# Altium schematic sheet 12 Processor  Power.SchDoc
size 594 x 420 mm
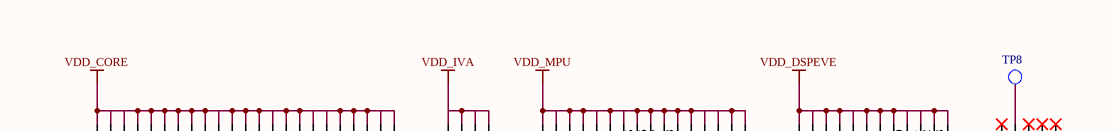
[diagram p0: 12 Processor  Power.SchDoc, top left]
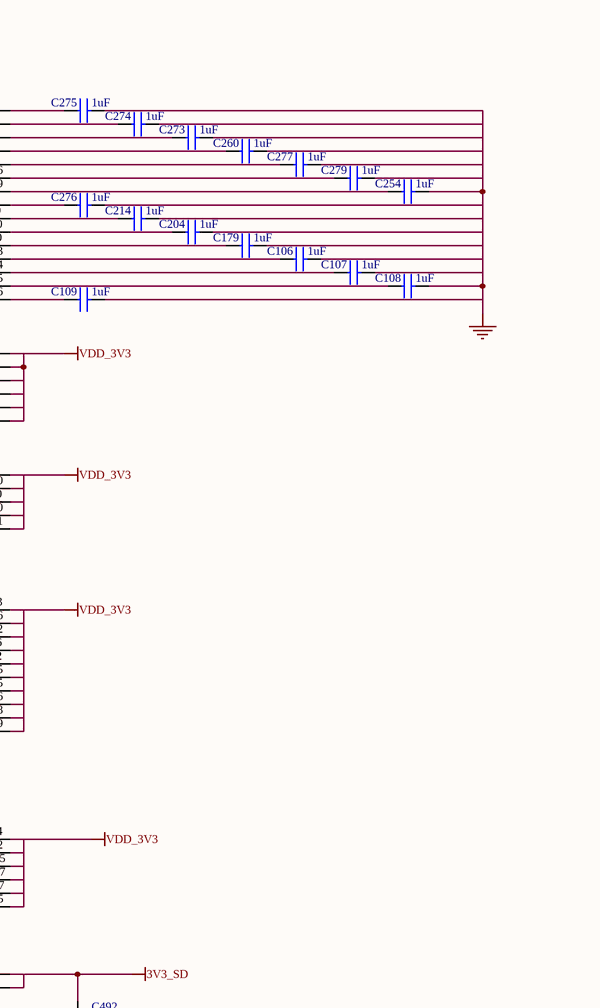
[diagram p1: 12 Processor  Power.SchDoc, top right]
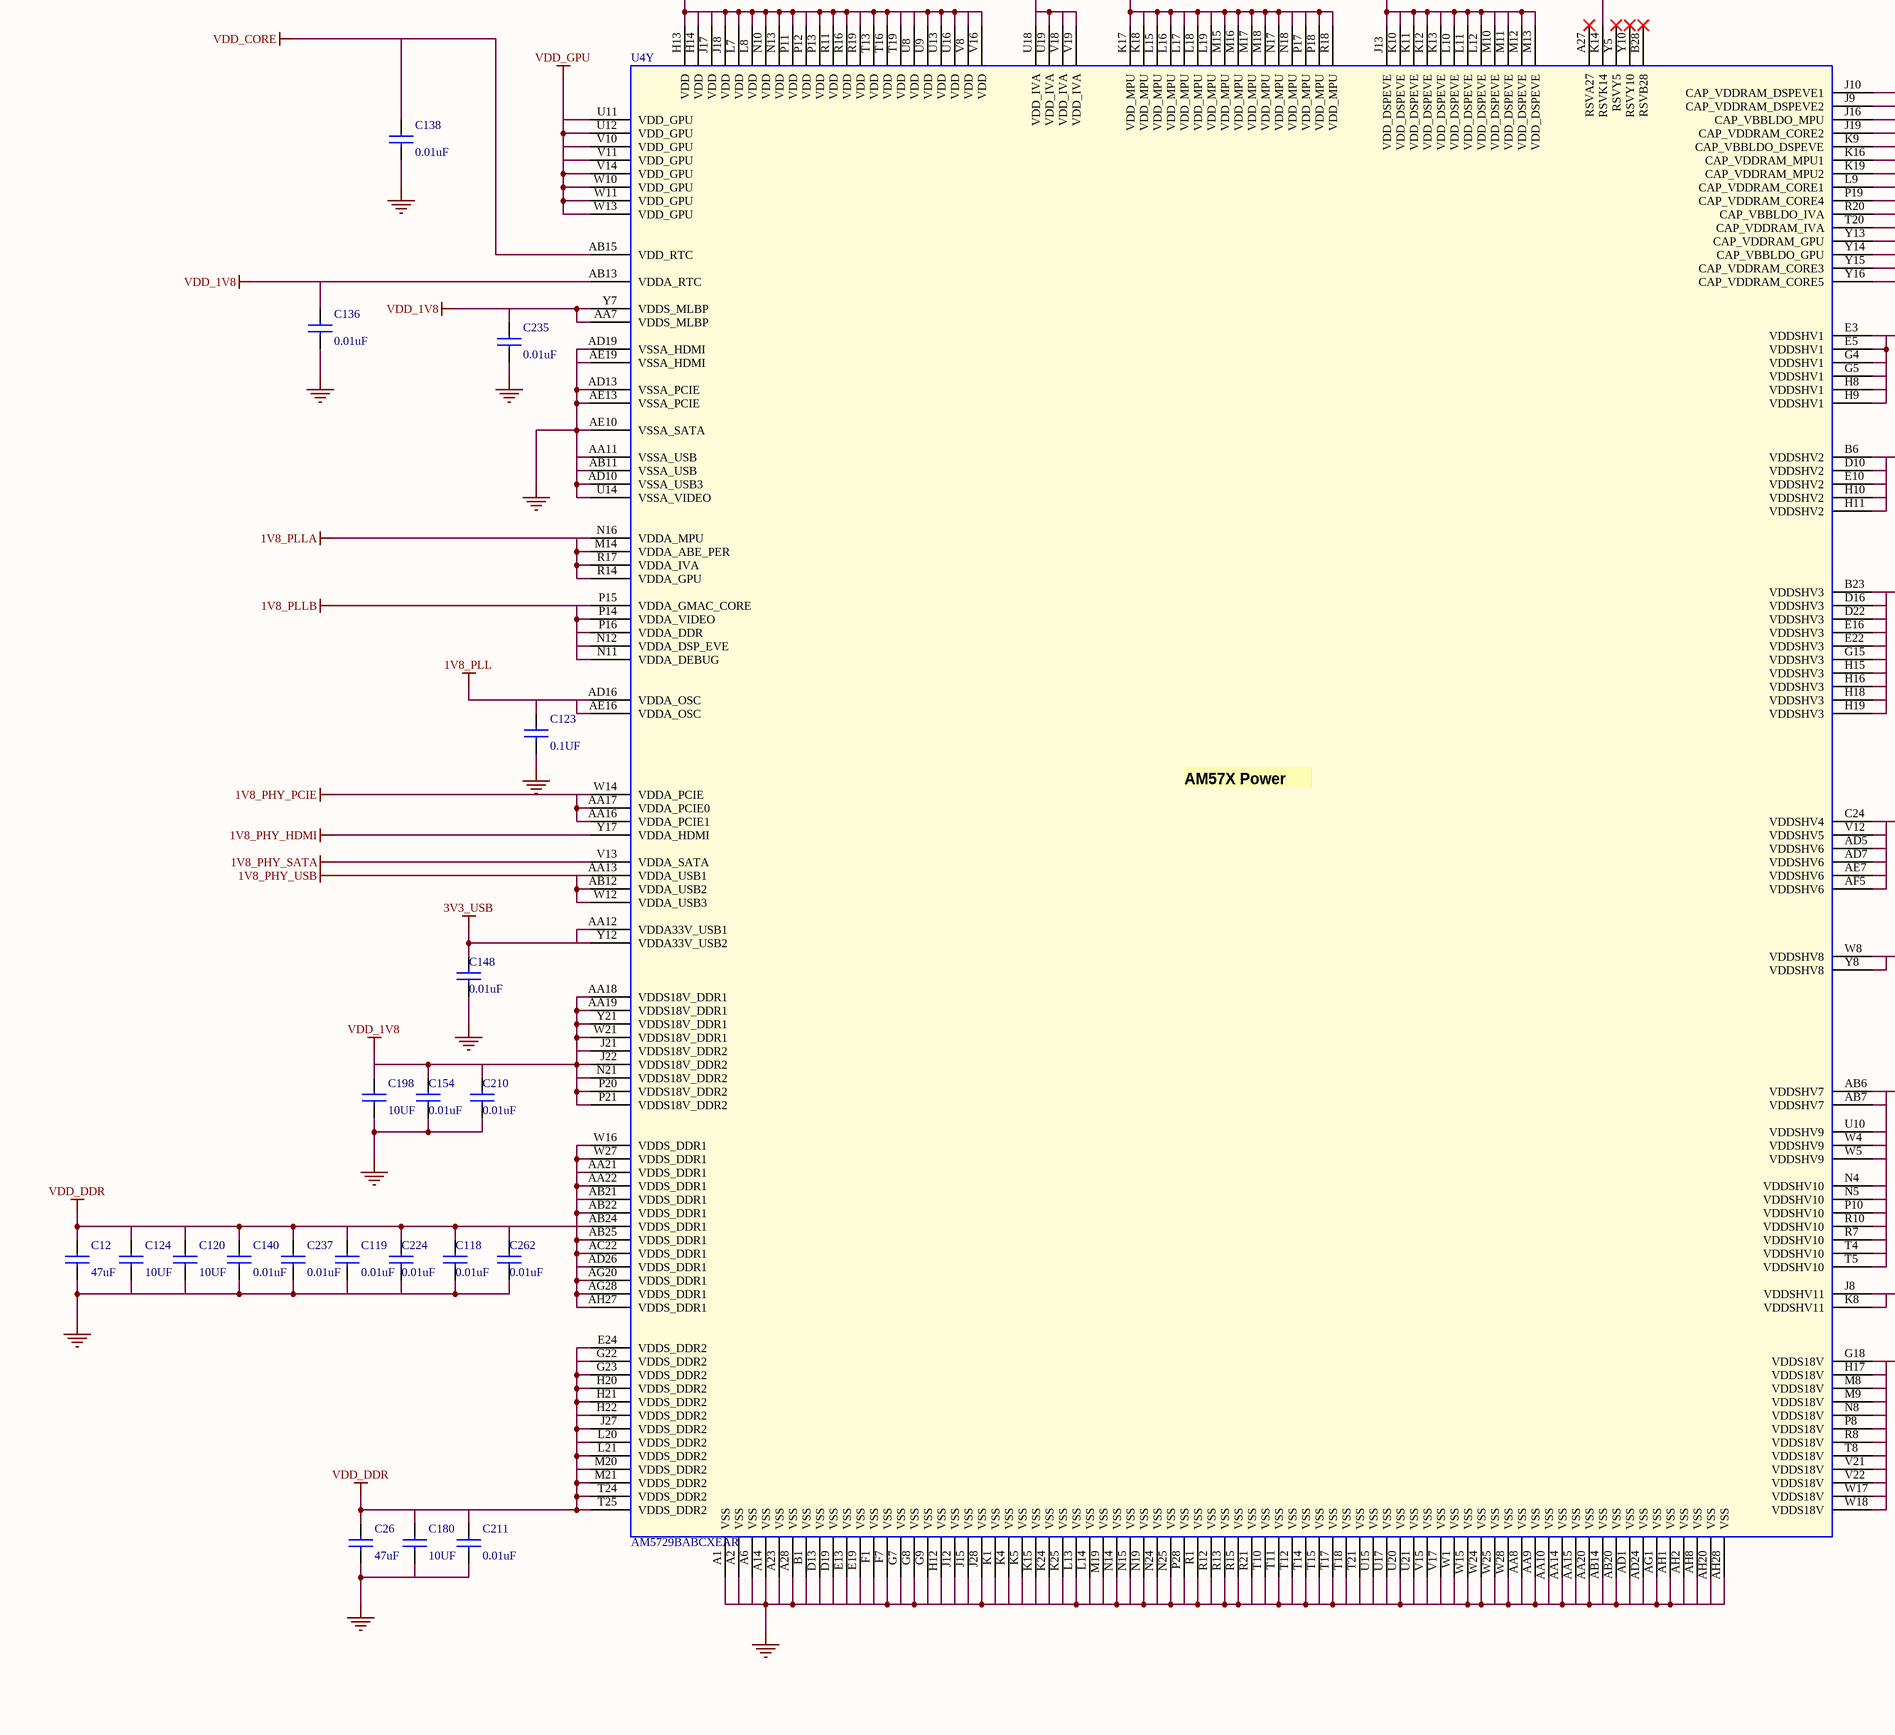
[diagram p2: 12 Processor  Power.SchDoc, bottom left]
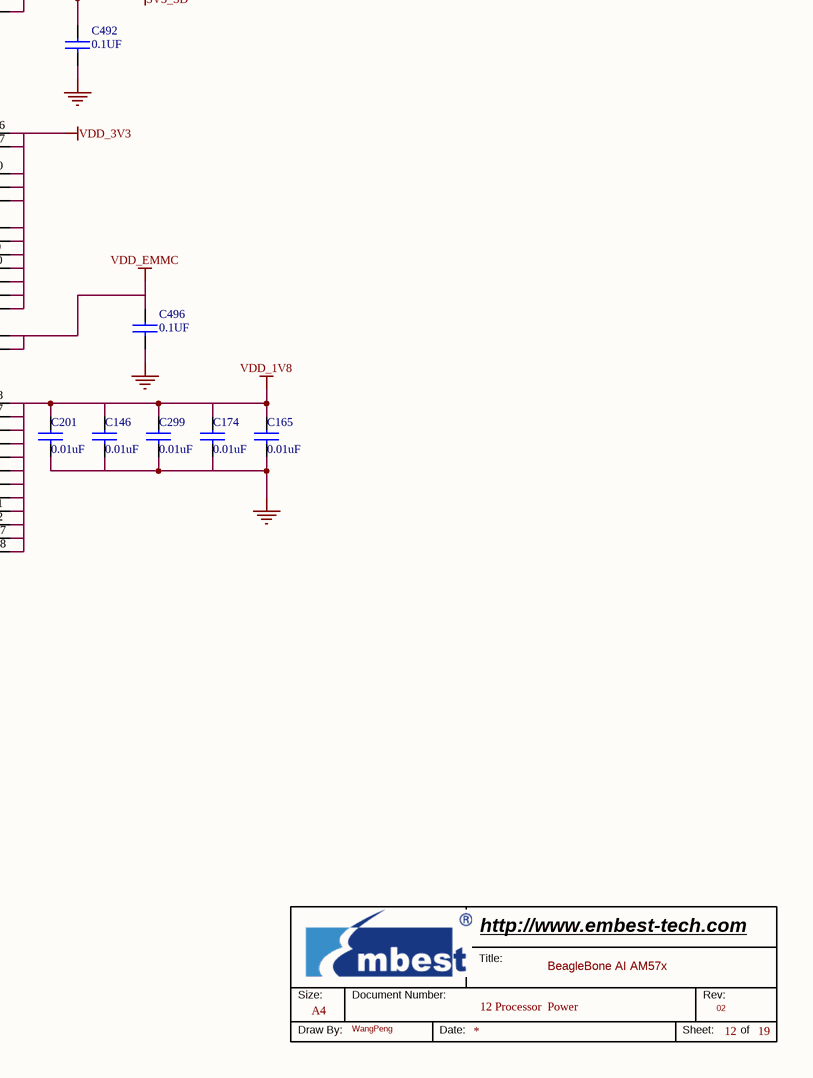
[diagram p3: 12 Processor  Power.SchDoc, bottom right]

## Parts
*  Page Count: 19  Page Number: 12  Page Size: A4  Title: BeagleBone AI AM57x  RevCode: 02  Doc: 12 Processor  Power  Drawing: WangPeng  (hidden comment: Embest Title)  (graphical)
C12  47uF  [C0805]
C26  47uF  [C0805]
C106  1uF  [C0402]
C107  1uF  [C0402]
C108  1uF  [C0402]
C109  1uF  [C0402]
C118  0.01uF  [C0402]
C119  0.01uF  [C0402]
C120  10UF  [C0603]
C123  0.1UF  [C0402]
C124  10UF  [C0603]
C136  0.01uF  [C0402]
C138  0.01uF  [C0402]
C140  0.01uF  [C0402]
C146  0.01uF  [C0402]
C148  0.01uF  [C0402]
C154  0.01uF  [C0402]
C165  0.01uF  [C0402]
C174  0.01uF  [C0402]
C179  1uF  [C0402]
C180  10UF  [C0603]
C198  10UF  [C0603]
C201  0.01uF  [C0402]
C204  1uF  [C0402]
C210  0.01uF  [C0402]
C211  0.01uF  [C0402]
C214  1uF  [C0402]
C224  0.01uF  [C0402]
C235  0.01uF  [C0402]
C237  0.01uF  [C0402]
C254  1uF  [C0402]
C260  1uF  [C0402]
C262  0.01uF  [C0402]
C273  1uF  [C0402]
C274  1uF  [C0402]
C275  1uF  [C0402]
C276  1uF  [C0402]
C277  1uF  [C0402]
C279  1uF  [C0402]
C299  0.01uF  [C0402]
C492  0.1UF  [C0402]
C496  0.1UF  [C0402]
TP8  NI  [TP1-8040]  (value not drawn)
U4  AM5729BABCXEAR  [BGA23X23-760-117M]  (part Y of 29)

## Nets
1V8_PHY_HDMI: U4.Y17(VDDA_HDMI)
1V8_PHY_PCIE: U4.AA16(VDDA_PCIE1) U4.AA17(VDDA_PCIE0) U4.W14(VDDA_PCIE)
1V8_PHY_SATA: U4.V13(VDDA_SATA)
1V8_PHY_USB: U4.AA13(VDDA_USB1) U4.AB12(VDDA_USB2) U4.W12(VDDA_USB3)
1V8_PLL: C123.1 U4.AD16(VDDA_OSC) U4.AE16(VDDA_OSC)
1V8_PLLA: U4.M14(VDDA_ABE_PER) U4.N16(VDDA_MPU) U4.R14(VDDA_GPU) U4.R17(VDDA_IVA)
1V8_PLLB: U4.N11(VDDA_DEBUG) U4.N12(VDDA_DSP_EVE) U4.P14(VDDA_VIDEO) U4.P15(VDDA_GMAC_CORE) U4.P16(VDDA_DDR)
3V3_SD: C492.1 U4.W8(VDDSHV8) U4.Y8(VDDSHV8)
3V3_USB: C148.1 U4.AA12(VDDA33V_USB1) U4.Y12(VDDA33V_USB2)
GND: C12.2 C26.2 C106.2 C107.2 C108.2 C109.2 C118.2 C119.2 C120.2 C123.2 C124.2 C136.2 C138.2 C140.2 C146.2 C148.2 C154.2 C165.2 C174.2 C179.2 C180.2 C198.2 C201.2 C204.2 C210.2 C211.2 C214.2 C224.2 C235.2 C237.2 C254.2 C260.2 C262.2 C273.2 C274.2 C275.2 C276.2 C277.2 C279.2 C299.2 C492.2 C496.2 U4.A1(VSS) U4.A2(VSS) U4.A6(VSS) U4.A14(VSS) U4.A23(VSS) U4.A28(VSS) U4.AA8(VSS) U4.AA9(VSS) U4.AA10(VSS) U4.AA11(VSSA_USB) U4.AA14(VSS) U4.AA15(VSS) U4.AA20(VSS) U4.AB11(VSSA_USB) U4.AB14(VSS) U4.AB20(VSS) U4.AD1(VSS) U4.AD10(VSSA_USB3) U4.AD13(VSSA_PCIE) U4.AD19(VSSA_HDMI) U4.AD24(VSS) U4.AE10(VSSA_SATA) U4.AE13(VSSA_PCIE) U4.AE19(VSSA_HDMI) U4.AG1(VSS) U4.AH1(VSS) U4.AH2(VSS) U4.AH8(VSS) U4.AH20(VSS) U4.AH28(VSS) U4.B1(VSS) U4.D13(VSS) U4.D19(VSS) U4.E13(VSS) U4.E19(VSS) U4.F1(VSS) U4.F7(VSS) U4.G7(VSS) U4.G8(VSS) U4.G9(VSS) U4.H12(VSS) U4.J12(VSS) U4.J15(VSS) U4.J28(VSS) U4.K1(VSS) U4.K4(VSS) U4.K5(VSS) U4.K15(VSS) U4.K24(VSS) U4.K25(VSS) U4.L13(VSS) U4.L14(VSS) U4.M19(VSS) U4.N14(VSS) U4.N15(VSS) U4.N19(VSS) U4.N24(VSS) U4.N25(VSS) U4.P28(VSS) U4.R1(VSS) U4.R12(VSS) U4.R13(VSS) U4.R15(VSS) U4.R21(VSS) U4.T10(VSS) U4.T11(VSS) U4.T12(VSS) U4.T14(VSS) U4.T15(VSS) U4.T17(VSS) U4.T18(VSS) U4.T21(VSS) U4.U14(VSSA_VIDEO) U4.U15(VSS) U4.U17(VSS) U4.U20(VSS) U4.U21(VSS) U4.V15(VSS) U4.V17(VSS) U4.W1(VSS) U4.W15(VSS) U4.W24(VSS) U4.W25(VSS) U4.W28(VSS)
VDD_1V8: C136.1 C146.1 C154.1 C165.1 C174.1 C198.1 C201.1 C210.1 C235.1 C299.1 U4.AA7(VDDS_MLBP) U4.AA18(VDDS18V_DDR1) U4.AA19(VDDS18V_DDR1) U4.AB13(VDDA_RTC) U4.G18(VDDS18V) U4.H17(VDDS18V) U4.J21(VDDS18V_DDR2) U4.J22(VDDS18V_DDR2) U4.M8(VDDS18V) U4.M9(VDDS18V) U4.N8(VDDS18V) U4.N21(VDDS18V_DDR2) U4.P8(VDDS18V) U4.P20(VDDS18V_DDR2) U4.P21(VDDS18V_DDR2) U4.R8(VDDS18V) U4.T8(VDDS18V) U4.V21(VDDS18V) U4.V22(VDDS18V) U4.W17(VDDS18V) U4.W18(VDDS18V) U4.W21(VDDS18V_DDR1) U4.Y7(VDDS_MLBP) U4.Y21(VDDS18V_DDR1)
VDD_3V3: U4.AB6(VDDSHV7) U4.AB7(VDDSHV7) U4.AD5(VDDSHV6) U4.AD7(VDDSHV6) U4.AE7(VDDSHV6) U4.AF5(VDDSHV6) U4.B6(VDDSHV2) U4.B23(VDDSHV3) U4.C24(VDDSHV4) U4.D10(VDDSHV2) U4.D16(VDDSHV3) U4.D22(VDDSHV3) U4.E3(VDDSHV1) U4.E5(VDDSHV1) U4.E10(VDDSHV2) U4.E16(VDDSHV3) U4.E22(VDDSHV3) U4.G4(VDDSHV1) U4.G5(VDDSHV1) U4.G15(VDDSHV3) U4.H8(VDDSHV1) U4.H9(VDDSHV1) U4.H10(VDDSHV2) U4.H11(VDDSHV2) U4.H15(VDDSHV3) U4.H16(VDDSHV3) U4.H18(VDDSHV3) U4.H19(VDDSHV3) U4.N4(VDDSHV10) U4.N5(VDDSHV10) U4.P10(VDDSHV10) U4.R7(VDDSHV10) U4.R10(VDDSHV10) U4.T4(VDDSHV10) U4.T5(VDDSHV10) U4.U10(VDDSHV9) U4.V12(VDDSHV5) U4.W4(VDDSHV9) U4.W5(VDDSHV9)
VDD_CORE: C138.1 U4.AB15(VDD_RTC) U4.H13(VDD) U4.H14(VDD) U4.J17(VDD) U4.J18(VDD) U4.L7(VDD) U4.L8(VDD) U4.N10(VDD) U4.N13(VDD) U4.P11(VDD) U4.P12(VDD) U4.P13(VDD) U4.R11(VDD) U4.R16(VDD) U4.R19(VDD) U4.T13(VDD) U4.T16(VDD) U4.T19(VDD) U4.U8(VDD) U4.U9(VDD) U4.U13(VDD) U4.U16(VDD) U4.V8(VDD) U4.V16(VDD)
VDD_DDR: C12.1 C26.1 C118.1 C119.1 C120.1 C124.1 C140.1 C180.1 C211.1 C224.1 C237.1 C262.1 U4.AA21(VDDS_DDR1) U4.AA22(VDDS_DDR1) U4.AB21(VDDS_DDR1) U4.AB22(VDDS_DDR1) U4.AB24(VDDS_DDR1) U4.AB25(VDDS_DDR1) U4.AC22(VDDS_DDR1) U4.AD26(VDDS_DDR1) U4.AG20(VDDS_DDR1) U4.AG28(VDDS_DDR1) U4.AH27(VDDS_DDR1) U4.E24(VDDS_DDR2) U4.G22(VDDS_DDR2) U4.G23(VDDS_DDR2) U4.H20(VDDS_DDR2) U4.H21(VDDS_DDR2) U4.H22(VDDS_DDR2) U4.J27(VDDS_DDR2) U4.L20(VDDS_DDR2) U4.L21(VDDS_DDR2) U4.M20(VDDS_DDR2) U4.M21(VDDS_DDR2) U4.T24(VDDS_DDR2) U4.T25(VDDS_DDR2) U4.W16(VDDS_DDR1) U4.W27(VDDS_DDR1)
VDD_DSPEVE: U4.J13(VDD_DSPEVE) U4.K10(VDD_DSPEVE) U4.K11(VDD_DSPEVE) U4.K12(VDD_DSPEVE) U4.K13(VDD_DSPEVE) U4.L10(VDD_DSPEVE) U4.L11(VDD_DSPEVE) U4.L12(VDD_DSPEVE) U4.M10(VDD_DSPEVE) U4.M11(VDD_DSPEVE) U4.M12(VDD_DSPEVE) U4.M13(VDD_DSPEVE)
VDD_EMMC: C496.1 U4.J8(VDDSHV11) U4.K8(VDDSHV11)
VDD_GPU: U4.U11(VDD_GPU) U4.U12(VDD_GPU) U4.V10(VDD_GPU) U4.V11(VDD_GPU) U4.V14(VDD_GPU) U4.W10(VDD_GPU) U4.W11(VDD_GPU) U4.W13(VDD_GPU)
VDD_IVA: U4.U18(VDD_IVA) U4.U19(VDD_IVA) U4.V18(VDD_IVA) U4.V19(VDD_IVA)
VDD_MPU: U4.K17(VDD_MPU) U4.K18(VDD_MPU) U4.L15(VDD_MPU) U4.L16(VDD_MPU) U4.L17(VDD_MPU) U4.L18(VDD_MPU) U4.L19(VDD_MPU) U4.M15(VDD_MPU) U4.M16(VDD_MPU) U4.M17(VDD_MPU) U4.M18(VDD_MPU) U4.N17(VDD_MPU) U4.N18(VDD_MPU) U4.P17(VDD_MPU) U4.P18(VDD_MPU) U4.R18(VDD_MPU)
NetC106_1: C106.1 U4.Y13(CAP_VDDRAM_GPU)
NetC107_1: C107.1 U4.Y14(CAP_VBBLDO_GPU)
NetC108_1: C108.1 U4.Y15(CAP_VDDRAM_CORE3)
NetC109_1: C109.1 U4.Y16(CAP_VDDRAM_CORE5)
NetC179_1: C179.1 U4.T20(CAP_VDDRAM_IVA)
NetC204_1: C204.1 U4.R20(CAP_VBBLDO_IVA)
NetC214_1: C214.1 U4.P19(CAP_VDDRAM_CORE4)
NetC254_1: C254.1 U4.K19(CAP_VDDRAM_MPU2)
NetC260_1: C260.1 U4.J19(CAP_VDDRAM_CORE2)
NetC273_1: C273.1 U4.J16(CAP_VBBLDO_MPU)
NetC274_1: C274.1 U4.J9(CAP_VDDRAM_DSPEVE2)
NetC275_1: C275.1 U4.J10(CAP_VDDRAM_DSPEVE1)
NetC276_1: C276.1 U4.L9(CAP_VDDRAM_CORE1)
NetC277_1: C277.1 U4.K9(CAP_VBBLDO_DSPEVE)
NetC279_1: C279.1 U4.K16(CAP_VDDRAM_MPU1)
NetTP8_1: TP8.1(TP) U4.K14(RSVK14)

Not connected (* = marked no-connect by the designer): U4 A27(RSVA27)* B28(RSVB28)* Y5(RSVY5)* Y10(RSVY10)*

## Notes on the sheet
- (in symbol AM57X, part Y) AM57X Power /
- (in symbol Embest Title) Title:; Size:; Document Number:; Rev:; Draw By:; Date:; Sheet:; of

## Library data of the parts
C12 C26 = C: CAP,47UF,+/-20%,X5R,6.3V,SMD0805; Manufacturer Part Number: GRM21BR60J476ME15L; Manufacturer: MURATA; Embest PN: 1004001100164; Part Type: Ceramic Capacitor
C106 C108 C204 C260 C274 C276 C279 = C: CAP,1UF,+/-10%,X5R,10V,SMD0402; Manufacturer Part Number: GRM155R61A105KE15D; Manufacturer: Murata; Embest PN: 1004001100057; Part Type: Ceramic Capacitor
C107 C109 C179 C214 C254 C273 C275 C277 = C: CAP,1UF,+/-10%,X5R,10V,SMD0402; Manufacturer: Murata; Manufacturer Part Number: GRM155R61A105KE15D; Embest PN: 1004001100057; Part Type: Ceramic Capacitor
C118 C136 C146 C148 C174 = C: CAP,10NF,+/-10%,X7R,16V,SMD0402; Manufacturer Part Number: GRM155R71C103KA01D; Manufacturer: MURATA; Embest PN: 1004001100039; Part Type: Ceramic Capacitor
C119 C138 C140 C154 C165 C201 C210 C211 C224 C235 C237 C262 C299 = C: CAP,10NF,+/-10%,X7R,16V,SMD0402; Manufacturer: MURATA; Manufacturer Part Number: GRM155R71C103KA01D; Embest PN: 1004001100039; Part Type: Ceramic Capacitor
C120 C124 = C: CAP,10UF,+/-10%,X5R,10V,SMD0603; Manufacturer: Murata; Manufacturer Part Number: GRM188R61A106KE69D; Embest PN: 1004001100129; Part Type: Ceramic Capacitor; Datasheet: Y:\ÐÂK3ÏµÍ³ÎïÁÏdatasheet\[1003_1004]capacitor-resistor µçÈÝ¡¢µç×è\1004001100129T2 C1608X5R1A106M.pdf
C123 = C: CAP,100NF,+/-10%,X7R,16V,SMD0402; Manufacturer Part Number: GRM155R71C104KA88D; Manufacturer: Murata; Embest PN: 1004001100047; Datasheet: Y:\ÐÂK3ÏµÍ³ÎïÁÏdatasheet\[1003_1004]capacitor-resistor µçÈÝ¡¢µç×è\1004001100047-GRM155R71C104KA88D.pdf; Part Type: Ceramic Capacitor
C180 C198 = C: CAP,10UF,+/-10%,X5R,10V,SMD0603; Manufacturer Part Number: GRM188R61A106KE69D; Manufacturer: Murata; Embest PN: 1004001100129; Datasheet: Y:\ÐÂK3ÏµÍ³ÎïÁÏdatasheet\[1003_1004]capacitor-resistor µçÈÝ¡¢µç×è\1004001100129T2 C1608X5R1A106M.pdf; Part Type: Ceramic Capacitor
C492 C496 = C: CAP,100NF,+/-10%,X7R,16V,SMD0402; Manufacturer: Murata; Manufacturer Part Number: GRM155R71C104KA88D; Embest PN: 1004001100047; Part Type: Ceramic Capacitor; Datasheet: Y:\ÐÂK3ÏµÍ³ÎïÁÏdatasheet\[1003_1004]capacitor-resistor µçÈÝ¡¢µç×è\1004001100047-GRM155R71C104KA88D.pdf
TP8 = TEST POINT: Test point,DIA 30mil; PCB Footprint: TP30; Embest PN: PN008; Part Type: TP
U4 = AM57X: IC ARM Dual Cortex-A15 Microprocessor FCBGA(ABC)-760 SMD JEDEC TRAY; Vendor: TI; Embest PN: 1002001100053; Status: BeagleBone AI; Manufacturer Part Number: AM5729BABCXEAR; Manufacturer: TI; Part Type: MPU
* = Embest Title: Page Create Date: May 29, 2006; WebSite: http://www.embest-tech.com; Company: Embest; Page Modify Date: *